# EAGLE design RxT6 (EAGLE 4.13)
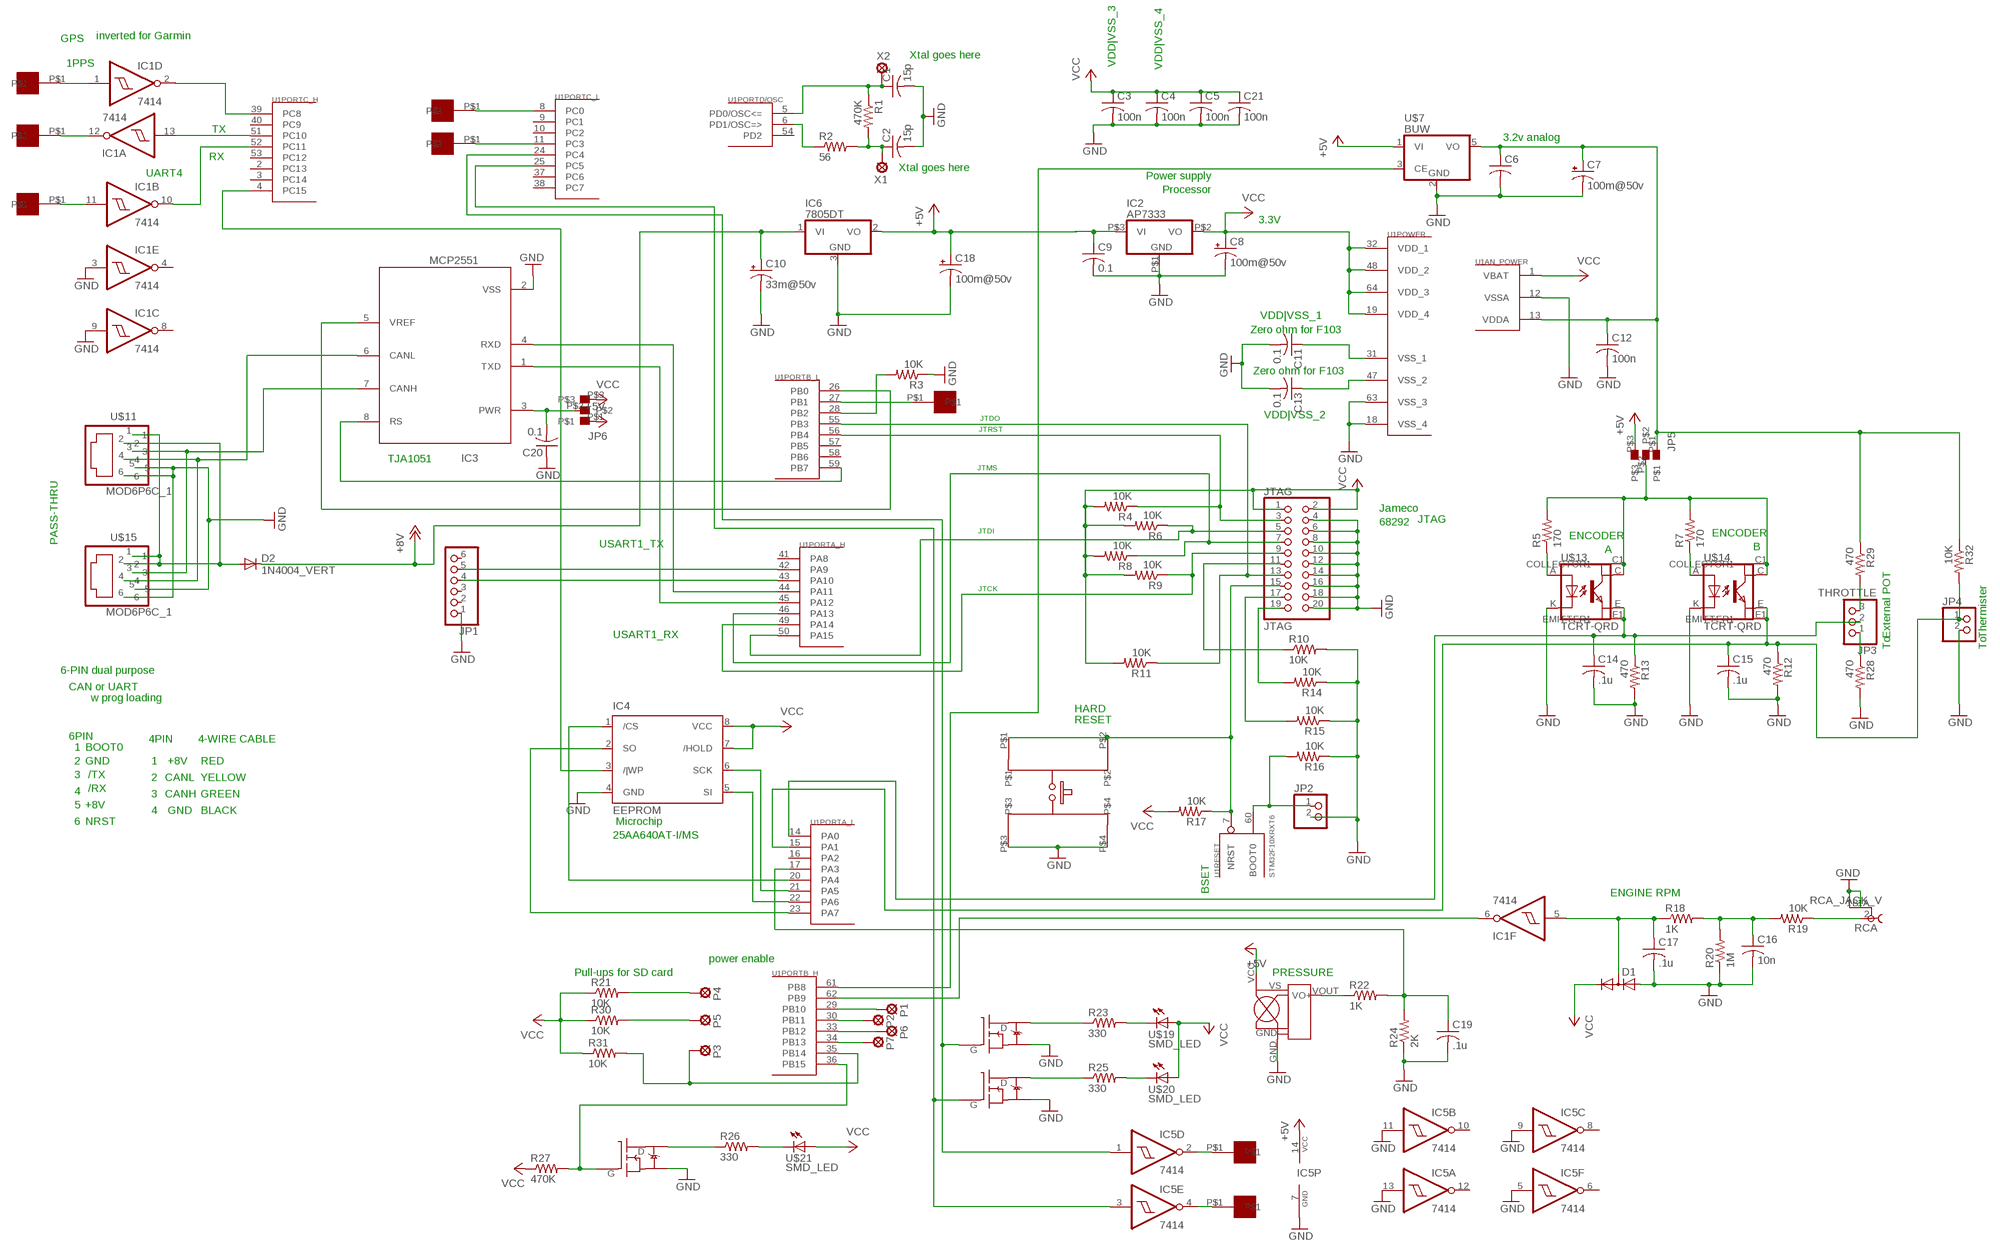
[diagram p0: schematic, sheet 1]

## Parts
C1  15p  C-USC0603  [C0603]
C2  15p  C-USC0603  [C0603]
C3  100n  C-USC0603  [C0603]
C4  100n  C-USC0603  [C0603]
C5  100n  C-USC0603  [C0603]
C6  C-USC0603  [C0603]
C7  100m@50v  CPOL-USE5-8.5  [E5-8,5]
C8  100m@50v  CPOL-USE5-8.5  [E5-8,5]
C9  0.1  C-USC0603  [C0603]
C10  33m@50v  CPOL-USE5-6  [E5-6]
C11  0.1  C-USC0603  [C0603]
C12  100n  C-USC0603  [C0603]
C13  0.1  C-USC0603  [C0603]
C14  .1u  C-USC0805  [C0805]
C15  .1u  C-USC0805  [C0805]
C16  10n  C-USC0805  [C0805]
C17  .1u  C-USC0805  [C0805]
C18  100m@50v  CPOL-USE5-8.5  [E5-8,5]
C19  .1u  C-USC0805  [C0805]
C20  0.1  C-USC0603  [C0603]
C21  100n  C-USC0603  [C0603]
D1  DIODE_2CACA-SOT23  [SOT23]
D2  1N4004_VERT  [DO41-10_VERT]
IC1  7414  [TSSOP14]
IC2  AP7333  MCP1702  [SOT-23A]
IC3  MCP2551  [SO-08]
IC4  EEPROM  [TSSOP8]
IC5  7414  [TSSOP14]
IC6  7805DT  [TO252]
JP1  PINHD-1X6  [1X06]
JP2  PINHD-1X2  [1X02]
JP3  THROTTLE  PINHD-1X3  [1X03]
JP4  PINHD-1X2  [1X02]
JP5  SMD-3  [SMD_3]
JP6  SMD-3  [SMD_3]
JTAG  JTAG  PINHD-2X10_KEYED  [2X10_KEYED]
P1  PE14  SOLDPAD028  [SOLPAD028]
P2  PE14  SOLDPAD028  [SOLPAD028]
P3  PE14  SOLDPAD028  [SOLPAD028]
P4  PE14  SOLDPAD028  [SOLPAD028]
P5  PE14  SOLDPAD028  [SOLPAD028]
P6  PE14  SOLDPAD028  [SOLPAD028]
P7  PE14  SOLDPAD028  [SOLPAD028]
Q1  IRLML2060  [SOT-23]
Q2  IRLML2060  [SOT-23]
Q3  IRLML2060  [SOT-23]
R1  470K  R-US_R0603  [R0603]
R2  56  R-US_R0603  [R0603]
R3  10K  R-US_R0603  [R0603]
R4  10K  R-US_R0603  [R0603]
R5  170  R-US_M0805  [M0805]
R6  10K  R-US_R0603  [R0603]
R7  170  R-US_M0805  [M0805]
R8  10K  R-US_R0603  [R0603]
R9  10K  R-US_R0603  [R0603]
R10  10K  R-US_R0603  [R0603]
R11  10K  R-US_R0603  [R0603]
R12  470  R-US_R0603  [R0603]
R13  470  R-US_R0603  [R0603]
R14  10K  R-US_R0603  [R0603]
R15  10K  R-US_R0603  [R0603]
R16  10K  R-US_R0603  [R0603]
R17  10K  R-US_R0603  [R0603]
R18  1K  R-US_R0603  [R0603]
R19  10K  R-US_R0603  [R0603]
R20  1M  R-US_R0603  [R0603]
R21  10K  R-US_R0603  [R0603]
R22  1K  R-US_R0603  [R0603]
R23  330  R-US_R0603  [R0603]
R24  2K  R-US_R0603  [R0603]
R25  330  R-US_R0603  [R0603]
R26  330  R-US_R0603  [R0603]
R27  470K  R-US_R0603  [R0603]
R28  470  R-US_R0603  [R0603]
R29  470  R-US_R0603  [R0603]
R30  10K  R-US_R0603  [R0603]
R31  10K  R-US_R0603  [R0603]
R32  10K  R-US_R0603  [R0603]
RCA  RCA_JACK_V  [RCA_JACK_V]
S1  SMD_1  [SMD_1]
S2  SMD_1  [SMD_1]
S3  SMD_1  [SMD_1]
S4  SMD_1  [SMD_1]
SW1  E-SWITCH  [E-SWITCH]
U1  STM32F10XRXT6  [TQFP64]
U$4  SMD_1  [SMD_1]
U$6  SMD_1  [SMD_1]
U$7  BUW  [SOT-25]
U$11  MOD6P6C_1  [MOD6P6C_1]
U$13  TCRT-QRD  [TCRT-QRD1114]
U$14  TCRT-QRD  [TCRT-QRD1114]
U$15  MOD6P6C_1  [MOD6P6C_1]
U$18  MPXV6115  [482A]
U$19  SMD_LED  [SMD_LED]
U$20  SMD_LED  [SMD_LED]
U$21  SMD_LED  [SMD_LED]
U$22  SMD_1  [SMD_1]
U$23  SMD_1  [SMD_1]
X1  SOLPAD035  [SOLDPAD035]
X2  SOLPAD035  [SOLDPAD035]

## Nets
1PPS_INPUT: IC1.1(D:I) S1.P$1
+5V: C9.1 C18.+ IC2.P$3(VI) IC5.14(P:VCC) IC6.2(VO) JP5.P$3 JP6.P$1 U$7.1(VI) U$18.VCC(VS)
+8V: C10.+ D2.C IC6.1(VI)
+V_RAW: D2.A U$11.1 U$11.2 U$15.1 U$15.2
BOOT0: JP2.1 R16.2 U1.60(RESET:BOOT0)
CAN_PWR: C20.2 IC3.3(PWR) JP6.P$2
CANH: IC3.7(CANH) U$11.3 U$15.3
CANL: IC3.6(CANL) U$11.4 U$15.4
EEPROM_/WP: IC4.3(/|WP) U1.4(PORTC_H:PC15)
ENCODER_A_ANODE: R5.1 U$13.A(ANODE)
ENCODER_B_ANODE: R7.1 U$14.A(ANODE)
GND: C1.2 C2.2 C3.2 C4.2 C5.2 C6.2 C7.- C8.- C9.2 C10.- C11.2 C12.2 C13.2 C14.2 C15.2 C16.2 C17.2 C18.- C19.2 C20.1 C21.2 D1.1(A) IC1.3(E:I) IC1.9(C:I) IC2.P$1(GND) IC3.2(VSS) IC4.4(GND) IC5.5(F:I) IC5.7(P:GND) IC5.9(C:I) IC5.11(B:I) IC5.13(A:I) IC6.3(GND) JP1.1 JP2.2 JP4.2 JTAG.4 JTAG.6 JTAG.8 JTAG.10 JTAG.12 JTAG.14 JTAG.16 JTAG.18 JTAG.20 Q1.2(S) Q2.2(S) Q3.2(S) R3.1 R10.2 R12.2 R13.2 R14.1 R15.1 R16.1 R20.1 R24.1 R28.2 RCA.1A RCA.1B SW1.P$3 SW1.P$4 U1.12(AN_POWER:VSSA) U1.18(POWER:VSS_4) U1.63(POWER:VSS_3) U$7.2(GND) U$11.5 U$11.6 U$13.K(CATHODE) U$14.K(CATHODE) U$15.5 U$15.6 U$18.GND
JTAG_R-TO-GND-11: JTAG.11 R10.1
JTAG_R-TO-GND-17: JTAG.17 R15.2
JTAG_R-TO-GND-19: JTAG.19 R14.2
JTDO: JTAG.13 R11.1 U1.55(PORTB_L:PB3)
JTRST: JTAG.3 R4.1 U1.56(PORTB_L:PB4)
N$1: JP3.1 R28.1
N$2: JP3.3 R29.2
NRST: JTAG.15 R17.1 SW1.P$1 SW1.P$2 U1.7(RESET:NRST)
PA0_PHOTO_EMITTER_A: C14.1 JP3.2 R13.1 U1.14(PORTA_L:PA0) U$13.E1(EMITTER1) U$13.E(EMITTER)
PA1_PHOTO_EMITTER_B: C15.1 JP4.1 R12.1 R32.2 U1.15(PORTA_L:PA1) U$14.E1(EMITTER1) U$14.E(EMITTER)
PA3_ADC123IN1_PRESSURE: C19.1 R22.2 R24.2 U1.17(PORTA_L:PA3)
PA4_EEPROM_/CS: IC4.1(/CS) U1.20(PORTA_L:PA4)
PA5_EEPROM_SCK: IC4.6(SCK) U1.21(PORTA_L:PA5)
PA6_EEPROM_SI: IC4.5(SI) U1.22(PORTA_L:PA6)
PA7_EEPROM_SO: IC4.2(SO) U1.23(PORTA_L:PA7)
PA9_USART1_TX: JP1.5 U1.42(PORTA_H:PA9)
PA10_USART1_RX: JP1.4 U1.43(PORTA_H:PA10)
PA11_CANRXD: IC3.4(RXD) U1.44(PORTA_H:PA11)
PA12_CANTXD: IC3.1(TXD) U1.45(PORTA_H:PA12)
PA13_JTIMS: JTAG.7 R8.1 U1.46(PORTA_H:PA13)
PA14_JTCK: JTAG.9 R9.1 U1.49(PORTA_H:PA14)
PA15_JTDI: JTAG.5 R6.1 U1.50(PORTA_H:PA15)
PB0_CAN_VREF: IC3.5(VREF) U1.26(PORTB_L:PB0)
PB1: S4.P$1 U1.27(PORTB_L:PB1)
PB2_BOOT1: R3.2 U1.28(PORTB_L:PB2)
PB7_CAN_RS: IC3.8(RS) U1.59(PORTB_L:PB7)
PB8_3.2V_ENABLE: U1.61(PORTB_H:PB8) U$7.3(CE)
PB10_USART3_TX|XBEE: P1.MP U1.29(PORTB_H:PB10)
PB11_ENG_PULSE: IC1.6(F:O) U1.62(PORTB_H:PB9)
PB11_USART3_RX|XBEE: P2.MP U1.30(PORTB_H:PB11)
PB12_LED_A_SERVO: IC5.2(D:O) U$22.P$1
PB12_SPI2_/CS: P6.MP U1.33(PORTB_H:PB12)
PB13_SPI2_SCK: P7.MP U1.34(PORTB_H:PB13)
PB14_SPI2_DO: P3.MP R31.2 U1.35(PORTB_H:PB14)
PB15_PWRLED: R26.2 U$21.C
PB15_PWRLED_D: Q3.3(D) R26.1
PB15_SPI2_DI: Q3.1(G) R27.2 U1.36(PORTB_H:PB15)
PB_13_LES_B_SERVO: IC5.4(E:O) U$23.P$1
PC0: U1.8(PORTC_L:PC0) U$4.P$1
PC3: U1.11(PORTC_L:PC3) U$6.P$1
PC4_LED: IC5.1(D:I) Q1.1(G) U1.24(PORTC_L:PC4)
PC4_LED1: R23.2 U$19.C
PC4_LED_D: Q1.3(D) R23.1
PC5_LED: IC5.3(E:I) Q2.1(G) U1.25(PORTC_L:PC5)
PC5_LED2: R25.2 U$20.C
PC5_LED_D: Q2.3(D) R25.1
PC8_HC74OUT: IC1.2(D:O) U1.39(PORTC_H:PC8)
PC10_UART4_INVERT: IC1.12(A:O) S2.P$1
PC10_USART4_TX_HC14IN: IC1.13(A:I) U1.51(PORTC_H:PC10)
PC11_UART4_INVERT: IC1.11(B:I) S3.P$1
PC11_USART4_RX_HC14OUT: IC1.10(B:O) U1.52(PORTC_H:PC11)
PD0_OSC_IN_XTAL: C1.1 R1.1 U1.5(PORTD/OSC:PD0/OSC<=) X2.MP
PD1_OSC_OUT: R2.1 U1.6(PORTD/OSC:PD1/OSC=>)
PD1_OSC_OUT_XTAL: C2.1 R1.2 R2.2 X1.MP
PHOTOSENSOR_V+: JP5.P$2 R5.2 R7.2 U$13.C1(COLLECTOR1) U$13.C(COLLECTOR) U$14.C1(COLLECTOR1) U$14.C(COLLECTOR)
PRESSURE_OUT: R22.1 U$18.VOUT
PU_SD_DAT1: P5.MP R30.2
PU_SD_DAT2: P4.MP R21.2
RPM_FILTERED: C17.1 D1.3(AC) IC1.5(F:I) R18.1
SPRK_PICKUP: C16.1 R18.2 R19.2 R20.2
SPRK_PICKUP_RAW: R19.1 RCA.2
V3.2_ANALOG: C6.1 C7.+ C12.1 JP5.P$1 R29.1 R32.1 U1.13(AN_POWER:VDDA) U$7.5(VO)
VCC: C3.1 C4.1 C5.1 C8.+ C21.1 D1.2(C) IC2.P$2(VO) IC4.7(/HOLD) IC4.8(VCC) JP6.P$3 JTAG.1 JTAG.2 R4.2 R6.2 R8.2 R9.2 R11.2 R17.2 R21.1 R27.1 R30.1 R31.1 U1.1(AN_POWER:VBAT) U1.19(POWER:VDD_4) U1.32(POWER:VDD_1) U1.48(POWER:VDD_2) U1.64(POWER:VDD_3) U$19.A U$20.A U$21.A
VSS_1: C11.1 U1.31(POWER:VSS_1)
VSS_2: C13.1 U1.47(POWER:VSS_2)
Unconnected: IC1.4(E:O) IC1.8(C:O) IC5.6(F:O) IC5.8(C:O) IC5.10(B:O) IC5.12(A:O) JP1.2 JP1.3 JP1.6 U1.2(PORTC_H:PC13) U1.3(PORTC_H:PC14) U1.9(PORTC_L:PC1) U1.10(PORTC_L:PC2) U1.16(PORTA_L:PA2) U1.37(PORTC_L:PC6) U1.38(PORTC_L:PC7) U1.40(PORTC_H:PC9) U1.41(PORTA_H:PA8) U1.53(PORTC_H:PC12) U1.54(PORTD/OSC:PD2) U1.57(PORTB_L:PB5) U1.58(PORTB_L:PB6)

## Notes on the sheet
- GPS | inverted for Garmin
- Xtal goes here
- 1PPS | VDD|VSS_3 | VDD|VSS_4
- TX
- 3.2v analog
- RX
- Xtal goes here
- UART4 | Power supply
- Processor
- 3.3V
- VDD|VSS_1
- Zero ohm for F103
- Zero ohm for F103
- JTDO
- VDD|VSS_2
- JTRST
- TJA1051
- JTMS
- Jameco
- 68292 | JTAG
- JTDI
- ENCODER | ENCODER
- PASS-THRU | USART1_TX
- A | B
- JTCK
- USART1_RX | External POT | Thermister
- To | To
- 6-PIN dual purpose
- CAN or UART
- w prog loading
- HARD
- RESET
- 6PIN | 4PIN | 4-WIRE CABLE
- 1 | BOOT0
- 2 | GND | 1 | +8V | RED
- 3 | /TX | 2 | CANL | YELLOW
- 4 | /RX
- 3 | CANH | GREEN
- 5 | +8V
- 4 | GND | BLACK
- 6 | NRST | Microchip
- 25AA640AT-I/MS
- BSET | ENGINE RPM
- power enable
- Pull-ups for SD card | PRESSURE

## Power pins joined to a net without a drawn wire
GND: IC1.7(P:GND)
VCC: IC1.14(P:VCC)

## Library data of the parts
C1-C6 C9 C11-C17 C19-C21 = rcl:C-US: CAPACITOR, American symbol
C7 C8 C10 C18 = rcl:CPOL-US: POLARIZED CAPACITOR, American symbol
D1 = diode-1:DIODE_2CACA-: 2 Diodes - Cathode-Anode|Cathode-Anode
D2 = diode:1N4004_VERT
IC1 IC5 = 74xx-us:74*14: Hex schmitt trigger INVERTER
IC2 = linear:MCP1702
IC3 = texas:MCP2551
IC4 = texas:EEPROM
IC6 = linear:78*: Positive VOLTAGE REGULATOR
JP1 = pinhead:PINHD-1X6: PIN HEADER
JP2 JP4 = pinhead:PINHD-1X2: PIN HEADER
JP3 = pinhead:PINHD-1X3: PIN HEADER
JP5 JP6 = solpad:SMD-3
JTAG = pinhead:PINHD-2X10_KEYED
P1-P7 = solpad:SOLDPAD028
Q1-Q3 = transistor-fet:IRLML2060
R1-R32 = rcl:R-US_: RESISTOR, American symbol
RCA = DEH:RCA_JACK_V
S1-S4 U$4 U$6 U$22 U$23 = solpad:SMD_1
SW1 = switch-misc:E-SWITCH
U1 = stm32:STM32F10XRXT6: STM32F101/103 64pin LQFP
U$7 = linear:BUW
U$11 U$15 = DEH:MOD6P6C_1
U$13 U$14 = tcrt5000:TCRT-QRD
U$18 = motorola-sensor-driver:MPXV6115
U$19-U$21 = led:SMD_LED
X1 X2 = solpad:SOLPAD035

## Board
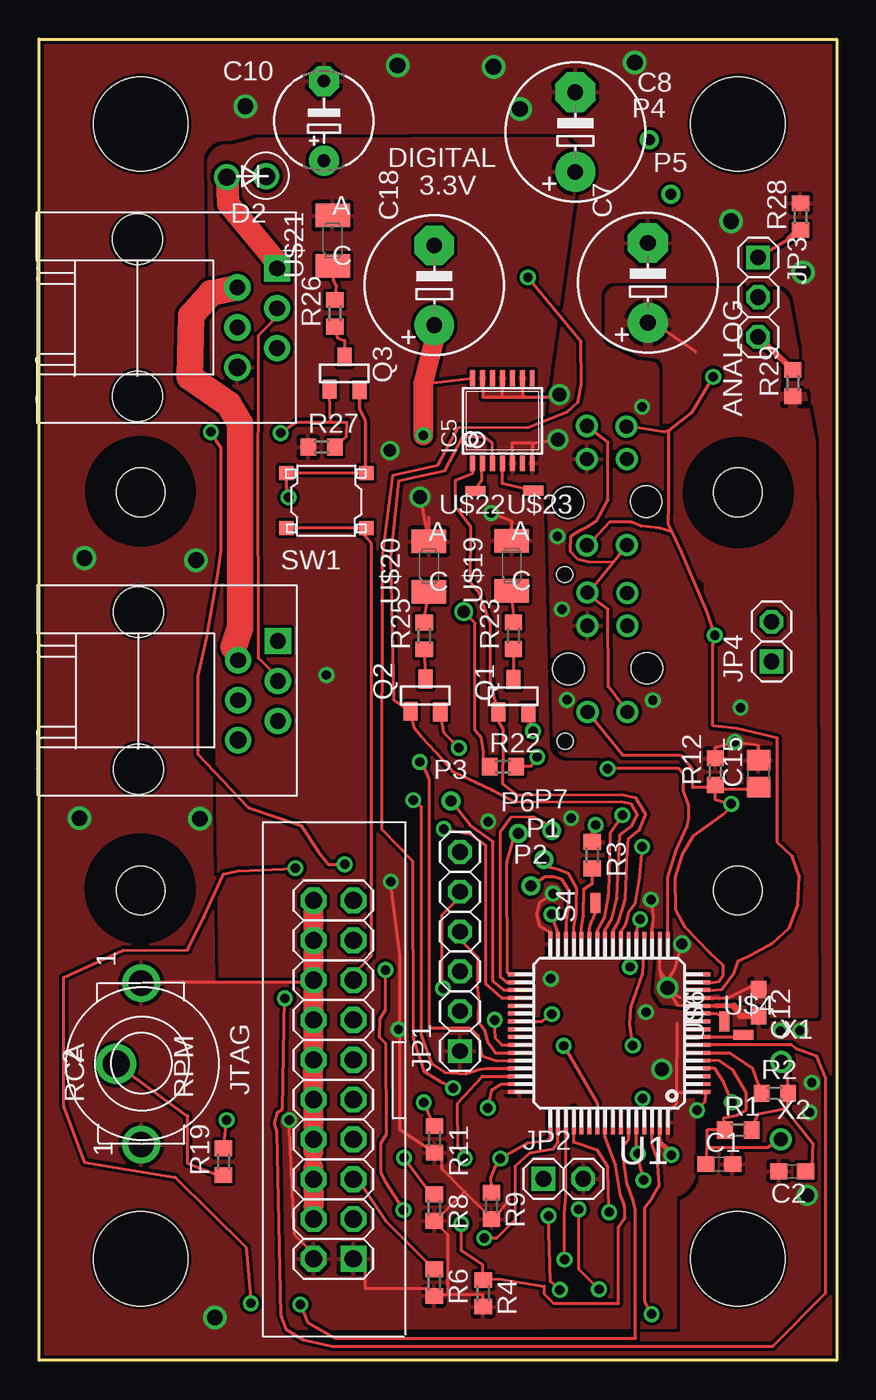
[diagram p1: board, top side]
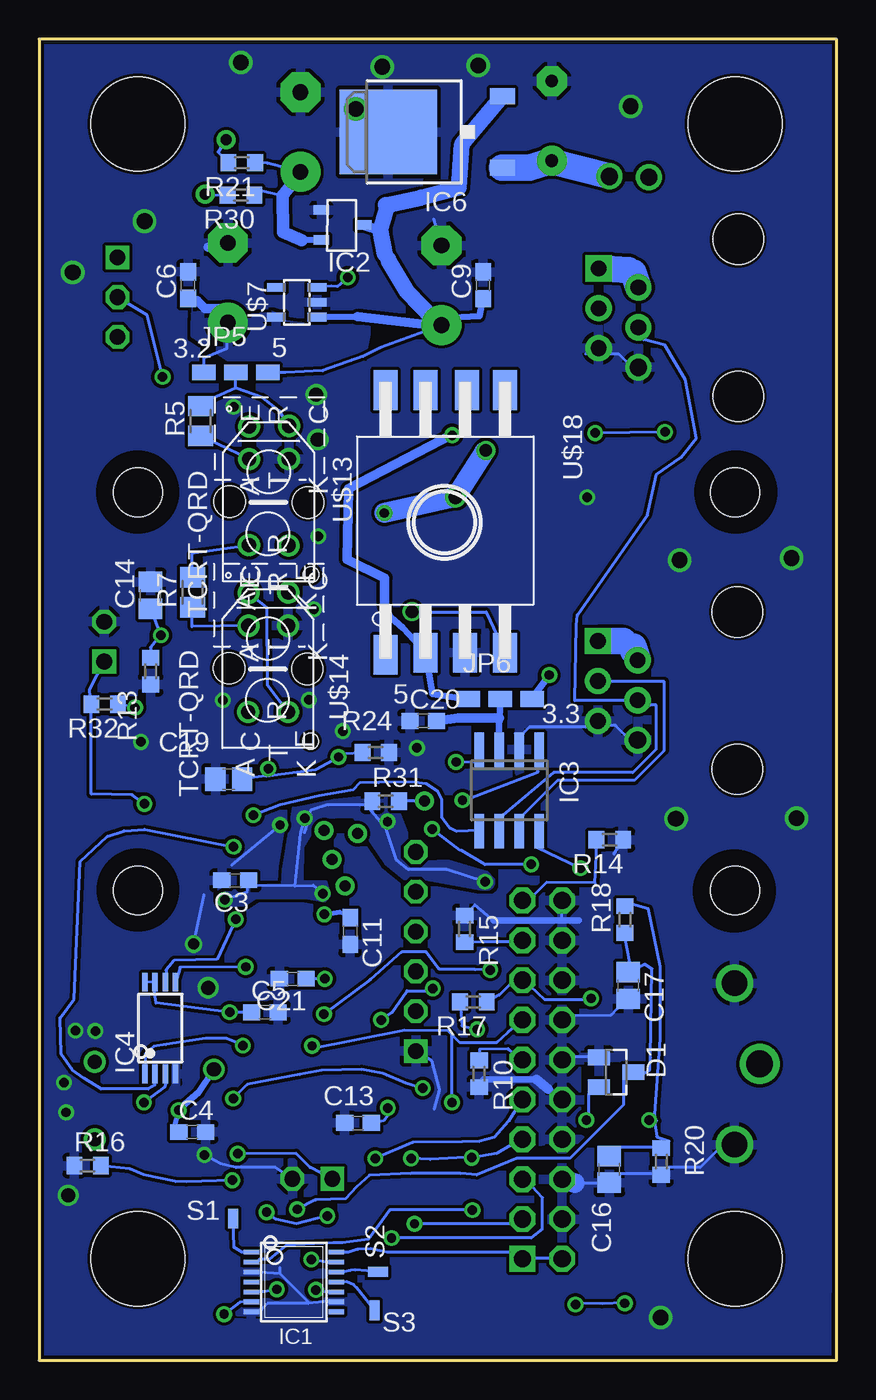
[diagram p2: board, bottom side, seen from below]

Size 50.88 x 84.28 mm. Coordinates in mm from the lower left corner, seen from the top.
Outline: 0,0 0,84.28 50.88,84.28 50.88,0 0,0
Copper layers (1*16): Top 0.035mm / dielectric 1.5mm / Bottom 0.035mm
Design rules "default": minimum track width 8mil, minimum drill 0.6mm, track to track 0.2083mm, track to pad 8mil, pad to pad 8mil, via to via 8mil, smd to smd 0mil, copper to edge 8mil, drill to drill 8mil, minimum pad ring 10mil, minimum via ring 8mil, stop-mask expansion 4mil, vias tented up to drill 0mil, thermal gap 10mil
Holes 6 mm at 6.48,6.48 44.58,6.48 6.48,78.87 44.58,78.87
Holes 3.1 mm at 6.48,29.97 6.48,55.37 44.58,29.97 44.58,55.37
tRestrict: area 41.2,51.9 to 48.1,58.8; area 41.1,26.6 to 47.9,33.4; area 3,26.7 to 9.9,33.5; area 3,52 to 9.9,58.9
bRestrict: area 4,27.4 to 9.1,32.5; area 3.9,52.9 to 9,57.9; area 42.1,52.9 to 47.1,57.9; area 42,27.5 to 47.1,32.6

### Footprints (pad centres in the part's own frame; a part is rotated, then mirrored left to right if it is on the bottom)
C0603 = smd 1.1 x 1: 1 -0.85,0; 2 0.85,0
E5-8,5 = drill 1 pad 2.54 round: + -2.54,0 | drill 1 pad 2.54 octagon: - 2.54,0
E5-6 = drill 0.8 pad 1.905 round: + -2.54,0 | drill 0.8 pad 1.905 octagon: - 2.54,0
C0805 = smd 1.3 x 1.5: 1 -0.85,0; 2 0.85,0
SOT23 = smd 1 x 1.4: 1 -0.95,-1.1; 2 0.95,-1.1; 3 0,1.1
DO41-10_VERT = drill 1.1 round: A 2.58,0.05; C 0.07,0
TSSOP14 = smd 0.305 x 0.991: 1 -1.905,-2.718; 2 -1.27,-2.718; 3 -0.635,-2.718; 4 0,-2.718; 5 0.635,-2.718; 6 1.27,-2.718; 7 1.905,-2.718; 8 1.905,2.718; 9 1.27,2.718; 10 0.635,2.718; 11 0,2.718; 12 -0.635,2.718; 13 -1.27,2.718; 14 -1.905,2.718
SOT-23A = smd 0.6 x 1: P$1 -0.95,-1.35; P$2 0.95,-1.35; P$3 0,1.35
SO-08 = smd 0.6 x 2.2: 1 -1.905,-2.6; 2 -0.635,-2.6; 3 0.635,-2.6; 4 1.905,-2.6; 5 1.905,2.6; 6 0.635,2.6; 7 -0.635,2.6; 8 -1.905,2.6
TSSOP8 = smd 1.2 x 0.35: 1 -2.925,0.975; 2 -2.925,0.325; 3 -2.925,-0.325; 4 -2.925,-0.975; 5 2.925,-0.975; 6 2.925,-0.325; 7 2.925,0.325; 8 2.925,0.975
TO252 = smd 1 x 1.6: 1 -2.28,-4.8; 2 2.28,-4.8 | smd 5.4 x 6.2: 3 0,2.5
1X06 = drill 1 square: 1 -6.35,0 | drill 1 octagon: 2 -3.81,0; 3 -1.27,0; 4 1.27,0; 5 3.81,0; 6 6.35,0
1X02 = drill 1 square: 1 -1.27,0 | drill 1 octagon: 2 1.27,0
1X03 = drill 1 square: 1 -2.54,0 | drill 1 octagon: 2 0,0; 3 2.54,0
SMD_3 = smd 1.5 x 1: P$1 -2.04,-0.27; P$2 0,-0.27; P$3 2.04,-0.27
2X10_KEYED = drill 1.1 square: 1 -11.46,-1.27 | drill 1.1 octagon: 2 -11.46,1.27; 3 -8.92,-1.27; 4 -8.92,1.27; 5 -6.38,-1.27; 6 -6.38,1.27; 7 -3.84,-1.27; 8 -3.84,1.27; 9 -1.3,-1.27; 10 -1.3,1.27; 11 1.24,-1.27; 12 1.24,1.27; 13 3.78,-1.27; 14 3.78,1.27; 15 6.32,-1.27; 16 6.32,1.27; 17 8.86,-1.27; 18 8.86,1.27; 19 11.4,-1.27; 20 11.4,1.27
SOLPAD028 = drill 0.7 pad 1.016 round: MP 0,0
SOT-23 = smd 0.9 x 1.2: 1 -1,-1.006; 2 0.9,-1.056; 3 -0.05,1.056
R0603 = smd 1 x 1.1: 1 -0.85,0; 2 0.85,0
M0805 = smd 1.3 x 1.6: 1 -0.95,0; 2 0.95,0
RCA_JACK_V = drill 1.6 round: 1A -5.15,0; 1B 5.15,0 | drill 1.7 round: 2 0,1.6
SMD_1 = smd 1.27 x 0.635: P$1 0,0
E-SWITCH = smd 0.9 x 0.9: P$1 -2.55,1.75; P$2 2.55,1.75; P$3 -2.55,-1.75; P$4 2.55,-1.75
TQFP64 = smd 1.5 x 0.25: 1 -5.7,3.75; 2 -5.7,3.25; 3 -5.7,2.75; 4 -5.7,2.25; 5 -5.7,1.75; 6 -5.7,1.25; 7 -5.7,0.75; 8 -5.7,0.25; 9 -5.7,-0.25; 10 -5.7,-0.75; 11 -5.7,-1.25; 12 -5.7,-1.75; 13 -5.7,-2.25; 14 -5.7,-2.75; 15 -5.7,-3.25; 16 -5.7,-3.75; 33 5.7,-3.75; 34 5.7,-3.25; 35 5.7,-2.75; 36 5.7,-2.25; 37 5.7,-1.75; 38 5.7,-1.25; 39 5.7,-0.75; 40 5.7,-0.25; 41 5.7,0.25; 42 5.7,0.75; 43 5.7,1.25; 44 5.7,1.75; 45 5.7,2.25; 46 5.7,2.75; 47 5.7,3.25; 48 5.7,3.75 | smd 0.25 x 1.5: 17 -3.75,-5.7; 18 -3.25,-5.7; 19 -2.75,-5.7; 20 -2.25,-5.7; 21 -1.75,-5.7; 22 -1.25,-5.7; 23 -0.75,-5.7; 24 -0.25,-5.7; 25 0.25,-5.7; 26 0.75,-5.7; 27 1.25,-5.7; 28 1.75,-5.7; 29 2.25,-5.7; 30 2.75,-5.7; 31 3.25,-5.7; 32 3.75,-5.7; 49 3.75,5.7; 50 3.25,5.7; 51 2.75,5.7; 52 2.25,5.7; 53 1.75,5.7; 54 1.25,5.7; 55 0.75,5.7; 56 0.25,5.7; 57 -0.25,5.7; 58 -0.75,5.7; 59 -1.25,5.7; 60 -1.75,5.7; 61 -2.25,5.7; 62 -2.75,5.7; 63 -3.25,5.7; 64 -3.75,5.7
SOT-25 = smd 0.55 x 1.2: 1 -0.95,-1.3; 2 0,-1.3; 3 0.95,-1.3; 4 0.95,1.3; 5 -0.95,1.3
MOD6P6C_1 = drill 1 pad 1.676 square: 1 -3.175,8.898 | drill 1 pad 1.676 round: 2 -1.951,6.358; 3 -0.627,8.898; 4 0.597,6.358; 5 1.921,8.898 | drill 1.1 pad 1.676 round: 6 3.145,6.358 | hole 3.2: -5.029,-0.01; 4.999,-0.01
TCRT-QRD1114 = drill 0.9 round: A -2.76,-1.26; C 2.73,-1.27; C1 -4.882,1.29; E 2.74,1.27; E1 -4.846,-1.25; K -2.76,1.28 | hole 2: 0,2.5; -0.05,-2.5 | hole 1: 4.6,2.7
482A = smd 2.54 x 1.524: GND 8.382,1.27; NC1 8.509,-3.81; NC2 -8.382,3.81; NC3 -8.382,1.397; NC4 -8.382,-1.27; NC5 -8.382,-3.81; VCC 8.382,-1.27; VOUT 8.382,3.81
SMD_LED = smd 2.2 x 1.5: A 0,1.6; C 0,-1.6
SOLDPAD035 = drill 0.9 pad 1.27 round: MP 0,0

### Placement (x,y rotation side)
C1  43.39,12.51 0 top
C2  48.05,12.06 180 top
C3  38.37,30.62 180 bottom
C4  41.12,14.57 0 bottom
C5  36.48,22.2 0 bottom
C6  41.38,68.59 90 bottom
C7  38.84,68.74 90 top
C8  34.21,78.36 90 top
C9  22.55,68.58 90 bottom
C10  18.17,79.07 90 top
C11  31.03,27.39 270 bottom
C12  45.91,22.82 270 top
C13  30.54,15.15 180 bottom
C14  43.78,48.8 90 bottom
C15  45.89,37.42 90 top
C16  14.51,12.18 270 bottom
C17  13.29,23.91 270 bottom
C18  25.21,68.58 90 top
C19  38.78,37.08 180 bottom
C20  26.37,40.79 0 bottom
C21  34.7,24.34 180 bottom
D1  14.06,18.38 270 bottom
D2  14.56,75.53 180 top
IC1  34.64,5 270 bottom
IC2  31.52,72.43 270 bottom
IC3  20.89,36.36 180 bottom
IC4  43.16,21.2 90 bottom
IC5  29.56,59.94 0 top
IC6  26.11,78.36 90 bottom
JP1  26.85,26.08 90 top
JP2  33.45,11.58 0 top
JP3  45.88,67.82 270 top
JP4  46.73,45.85 90 top
JP5  38.33,63.29 0 bottom
JP6  21.45,42.46 0 bottom
JTAG  18.78,17.93 90 top
P1  32.2,31.94 0 top
P2  31.37,30.26 0 top
P3  26.28,35.67 0 top
P4  38.94,77.86 0 top
P5  40.3,74.39 0 top
P6  30.57,33.6 0 top
P7  32.7,33.79 0 top
Q1  30.31,42.37 0 top
Q2  24.69,42.41 0 top
Q3  19.53,62.96 0 top
R1  44.6,14.69 0 top
R2  46.94,17.03 0 top
R3  35.29,32.22 270 top
R4  28.33,4.28 270 top
R5  40.57,59.92 90 bottom
R6  25.21,4.96 270 top
R7  41.09,49 90 bottom
R8  25.21,9.74 270 top
R9  28.85,9.86 270 top
R10  22.81,18.28 270 bottom
R11  25.23,14.1 270 top
R12  43.15,37.56 90 top
R13  43.77,43.96 270 bottom
R14  14.47,33.21 180 bottom
R15  23.73,27.52 270 bottom
R16  47.79,12.42 0 bottom
R17  23.18,22.86 180 bottom
R18  13.5,28.11 90 bottom
R19  11.76,12.67 90 top
R20  11.19,12.68 90 bottom
R21  37.95,76.4 180 bottom
R22  29.59,37.87 0 top
R23  30.26,46.22 90 top
R24  29.4,38.77 180 bottom
R25  24.57,46.22 90 top
R26  18.87,66.79 90 top
R27  18.02,58.26 0 top
R28  48.58,72.96 90 top
R29  48.09,62.34 90 top
R30  38.01,74.33 180 bottom
R31  28.77,35.67 0 bottom
R32  46.7,41.86 180 bottom
RCA  6.51,18.91 90 top
S1  38.51,9.04 270 bottom
S2  29.25,5.64 180 bottom
S3  29.48,3.2 270 bottom
S4  35.48,29.19 90 top
SW1  18.32,54.84 180 top
U1  36.36,20.87 180 top
U$4  44.93,20.76 0 top
U$6  43.71,21.61 90 top
U$7  34.45,67.5 90 bottom
U$11  6.34,42.71 270 top
U$13  36.23,54.73 270 bottom
U$14  36.27,44.1 270 bottom
U$15  6.29,66.49 270 top
U$18  24.97,53.52 270 bottom
U$19  30.15,50.69 0 top
U$20  24.87,50.64 0 top
U$21  18.72,71.43 0 top
U$22  27.84,55.46 0 top
U$23  31.53,55.47 0 top
X1  47.35,19.04 0 top
X2  47.33,14.1 0 top

### Tracks (layer width: path | path; a pad name or v marks a point on that pad's centre or on a via)
1PPS_INPUT
  Bottom 0.203: IC1.1 37.94,6.9 38.45,7.2 S1.P$1
+5V  (via drill 0.6)
  Top 0.203: 24.51,62.34 24.66,62.3 IC5.14
  Top 1.27: v24.52,59.02 24.51,62.34 25.3,65.3 25.3,65.35 C18.+
  Bottom 0.203: JP6.P$1 23.53,42.16 | C18.+ 25.21,65.94 | JP5.P$3 35.16,63.01 32.79,63.13 30.19,64.05 29.11,64.6 25.25,66.02 C18.+ | C18.+ 25.33,65.96
  Bottom 0.406: 28.84,48.11 28.42,47.37 27.67,46.71 U$18.VCC 25.77,42.52 23.53,42.16 | C18.+ 25.74,66.44 22.79,66.6 22.59,67.61 C9.1 | 29.1,72.05 29.06,72.05 | 30.57,66.58 U$7.1
  Bottom 0.61: 28.84,48.11 28.83,49.91 31.25,51.09 31.14,55.6 24.53,59.05 | 29.1,72.05 IC2.P$3 | 28.61,70.22 28.82,70.57 | 25.33,65.96 30.57,66.58
  Bottom 0.813: 29.1,72.05 29.1,72.09 | 28.66,73.64 28.72,73.72 28.76,73.7
  Bottom 1.016: 29.1,72.09 28.66,73.64 | IC6.2 23.89,77.59 24.1,74.82 26.51,74.18 28.76,73.7 | 25.74,66.44 27.37,68.13 28.61,70.22 | 28.82,70.57 29.1,72.05 | 24.53,59.05 v24.52,59.02
+8V
  Bottom 1.676: D2.C 18.25,76.49 C10.+ 19.61,76.09 21.34,76.09 IC6.1
+V_RAW
  Top 0.203: U$15.1 15.2,70
  Top 0.813: U$11.2 12.4,45.5
  Top 1.422: 15.2,70 12.04,73.78 D2.A
  Top 1.676: 12.4,45.5 12.82,46.75 12.81,59.76 12.09,61.01 9.6,62.73 9.69,66.66 10.97,68.09 U$15.2
  Bottom 0.203: 12.96,45.53 13.35,44.98 | 12.95,69.38 13.5,68.9 13.29,69.56
  Bottom 0.813: 13.35,44.98 13.61,45.88
  Bottom 1.676: U$11.2 12.96,45.53 | 13.61,45.88 U$11.1 | U$15.2 12.95,69.38 | 13.29,69.56 U$15.1
BOOT0  (via drill 0.6)
  Top 0.203: 38.1,13.2 38.1,14.5 U1.60 | 38.1,13.2 v38.56,11.49 | v38.21,13.18 38.1,13.2
  Bottom 0.203: v38.56,11.49 41.5,11.4 42.19,11.41 44.22,11.84 45.1,12.2 R16.2 | v38.21,13.18 34.5,13.2 33.6,12.3 JP2.1
CAN_PWR
  Bottom 0.203: IC3.3 21.6,39.08
  Bottom 0.406: 21.6,39.08 21.51,40.98 JP6.P$2
  Bottom 0.61: 21.51,40.98 21.53,40.98 24.15,40.99 C20.2
CANH
  Top 0.203: U$15.3 14.9,66.3 14,65.4 13.99,60.55 13.97,57.81 14,44.8 14.8,44 U$11.3
  Bottom 0.203: IC3.7 20,34.8 17.8,37 12.9,37 11,38.9 11,43.3 14.4,43.3 U$11.3
CANL
  Bottom 0.203: IC3.6 21.3,34.8 18.06,37.5 13,37.5 11.5,39 11.5,41.8 11.9,41.8 U$11.4 13.5,42.1 16.7,42.09 16.6,46.92 16.55,47.55 12.07,53.92 11.5,56.49 9.92,57.6 8.96,58.82 9.65,62.56 10.96,64.77 12.3,65.1 U$15.4
EEPROM_/WP  (via drill 0.6)
  Top 0.203: U1.4 43.11,18.61 43.68,17.74 v44.2,16.45
  Bottom 0.203: IC4.3 42.82,17.67 42.86,17.45 v44.2,16.45
ENCODER_A_ANODE
  Bottom 0.203: R5.1 40.15,58.77 U$13.A
ENCODER_B_ANODE
  Bottom 0.203: R7.1 41.12,46.8 37.55,46.86 U$14.A
GND  (via drill 0.6, 0.7, 0.9, 1)
  Top 0.203: 34.86,32.63 R3.1 35.3,33.62 v35.51,34.15 | JTAG.8 17.5,14.9 | 17.5,15.9 JTAG.10 17.5,17.12 | 17.5,9.8 JTAG.4 | JTAG.6 17.5,10.8 | 17.5,12.3 17.5,13.3 | JTAG.16 17.5,25 | 17.5,26 JTAG.18 17.5,27.6 | 17.5,19.9 JTAG.12 17.49,18.56 | 17.5,21.06 JTAG.14 17.52,22.29 | 17.5,23.5 JTAG.16 | 17.5,28.6 JTAG.20 | JTAG.16 16.7,24.1 7.6,24.1 | U1.63 39.61,14.11 39.66,13.83 | v40.34,13.1 40.12,13.38 | v40.1,23.77 39.91,23.64 40.9,23.14 | 39.61,24.88 U1.18 | v40.1,23.77 39.94,23.55 39.61,24.88 | v26.78,39.07 25.84,40.03 Q2.2 | v31.51,40.14 31.47,40.03 Q1.2 | v41.02,26.55 40.58,25.04 40.06,24.07 39.61,24.88 | SW1.P$3 20.31,56.6 | v15.91,55.06 15.78,55.72 SW1.P$4 20.28,56.63 SW1.P$3 | v33.2,61.6 32.48,61.46 30.98,61.46 | 30.98,61.46 30.88,61.46 30.86,62.63 IC5.9 | IC5.11 29.56,61.46 29.63,61.46 | 30.98,61.46 30.98,61.44 29.63,61.46 | IC5.13 28.31,61.44 29.63,61.44 29.63,61.46 | IC5.5 30.19,58.53 31.44,58.53 | 31.44,58.53 31.46,58.53 31.44,57.21 IC5.7 | 31.44,58.53 31.44,58.51 v33.1,58.74 | v40.1,23.77 40.11,23.75 40.75,22.63 U1.12 42.22,22.63 43.22,22.63 | Q3.2 20.45,60.7 20.82,59.97 20.81,57.12 20.27,56.55 SW1.P$3 | C15.2 45.88,39.25 44.42,39.46 v44.39,39.45 44.49,39.51 43.15,39.1 R12.2
  Top 0.305: 39.66,13.83 40,13.57 40.12,13.38 | 43.22,22.63 44.37,22.62
  Top 0.406: C12.2 44.75,21.97 44.37,22.62 | 17.5,28.6 17.51,28.2 17.35,28.11 17.36,28.1
  Top 1.27: 17.5,14.9 17.5,15.9 | 17.5,10.8 17.5,9.8 | 17.5,13.3 JTAG.8 | JTAG.6 17.5,12.3 | 17.5,25 17.5,26 | 17.5,19.9 17.5,21.06 | 17.52,22.29 17.5,23.5 | 17.5,27.6 17.5,28.6 | 17.5,17.12 17.49,18.56
  Bottom 0.203: 16,64.2 U$15.5 14.4,64.2 13.9,64.2 13.4,63.7 U$15.6 | C18.- 25.7,72.8 | v35.51,34.15 38.6,31.6 | 33.72,3.63 36.32,3.63 36.72,3.23 36.83,3.06 IC1.7 | 33.72,3.63 32.41,3.75 IC1.9 | 35.52,5.53 36.77,5.61 IC1.3 | 35.52,5.53 33.72,3.73 33.72,3.63 | JP2.2 35.8,12.3 38.33,12.3 39.31,12.55 40.36,13.1 v40.34,13.1 | 35.52,5.53 35.52,5.93 | 16.7,11.3 15.2,11.3 C16.2 13.8,11.9 11.7,11.9 R20.1 10.7,12.3 8.7,12.3 7.7,13.3 | 20.5,40 IC3.2 20,40 19.6,40.4 16,40.4 U$11.5 14.4,40.5 14.1,40.5 13.5,39.9 U$11.6 | 21.89,28.05 23.08,29.06 R15.1 | 16.44,28.07 17.57,28.2 JTAG.20 16.8,29.7 | 14.2,32.3 R14.1 | D1.1 15.8,19.4 16.7,19.4 JTAG.12 | C17.2 13.98,22.44 14.38,22.04 16.7,22 JTAG.14 | 22.54,17.93 R10.2 | C6.2 41.79,69.54 | v41.02,26.55 40.37,29.7 | 25.68,16.04 25.35,17.31 25.83,19.1 26.88,19.74 JP1.1
  Bottom 0.406: 21.89,28.05 19.22,28.05 16.44,28.07 | 19.14,17.91 22.54,17.93 | JTAG.10 18.37,17.29
  Bottom 0.61: 18.37,17.29 19.14,17.91 | 40.1,71 39.2,71 C7.-
  Bottom 1.27: 16.7,11.3 JTAG.6
  other vias: 10.25,34.56 2.56,34.59 2.88,51.18 10.01,51.05 13.15,80 22.87,82.61 28.99,82.52 44.15,72.67 48.56,21.03 49.02,10.53 49.3,17.71 49.16,15.82 38.01,82.79 30.68,79.83 11.22,2.73 38.47,60.83 39.16,42.11 33.68,42.13 33.07,52.57 33.36,47.91 48.74,69.41 47.3,21.01
  pour Bottom (rank 4): 50.35,83.96 50.62,83.91 50.49,0.43 50.32,0.37 0.62,0.33 0.62,0.51 0.29,84
  pour Top (rank 2): 41.11,22.64 41.07,24.82 41.68,26.44 41.41,26.97 40.94,27.35 40.57,27.19 40.56,26.5 40.48,25.65 39.49,25.63 39.37,24.62 39.28,23.53 39.79,22.76
  pour Top (rank 5): 0.2,0.04 50.85,0.04 50.86,84.21 0.05,84.22
  pour Bottom: 16.37,14.32 16.41,23.67 16.51,30 18.57,29.97 19.5,29.41 19.37,28.98 20.92,28.6 21.03,25.68 28.36,25.91 30.19,20.93 28.4,17.95 21.92,13.07
JTAG_R-TO-GND-11
  Bottom 0.203: R10.1 22.78,19.85 20.96,19.88 JTAG.11
JTAG_R-TO-GND-17
  Bottom 0.203: R15.2 22.7,26.7 20.8,26.7 JTAG.17
JTAG_R-TO-GND-19
  Bottom 0.203: R14.2 15.34,32.16 15.42,30.45 18.5,30.5 19.3,29.7 JTAG.19
JTDO  (via drill 0.6)
  Top 0.203: v24.54,16.45 25,15.4 R11.1 | v33.47,20.06 35.61,16.39 35.6,15.9 U1.55
  Bottom 0.203: 24.06,20.28 21.67,20.29 20.98,20.92 JTAG.13 | v24.54,16.45 24.54,20.76 24.06,20.28 | v33.47,20.06 33.68,19.84 27.57,21.05 24.78,21.03 24.06,20.28
JTRST  (via drill 0.6)
  Top 0.203: U1.56 36.1,14.5 36.1,14.3 36.77,12.5 37.08,10.57 37.28,10.09 37.36,9.74 37.38,9.1 36.95,8.51 36.97,3.63 32.82,3.63 32.22,4.23 32.22,4.73 29.3,5.2 R4.1 28.3,6.1 26.93,7.01 v26.93,8.71
  Bottom 0.203: v26.93,8.71 20.8,8.7 JTAG.3
N$1
  Top 0.203: JP3.1 47.85,71.55
  Top 0.406: 47.85,71.55 R28.1
N$2
  Top 0.203: 46.12,65.05 JP3.3
  Top 0.406: R29.2 46.12,65.05
NRST  (via drill 0.6)
  Top 0.203: v15.67,23.09 15.52,16.02 15.2,15.81 15.01,15.13 15.18,14.59 15.44,2.87 15.79,1.94 16.83,1.3 18.71,0.88 46.8,0.9 50.2,4.3 50.19,18.03 49.62,19.39 48.31,19.86 48.01,20.13 U1.7 | JTAG.15 20.4,25 21.2,25.8 21.2,52.1 20.31,53.11 SW1.P$1 | SW1.P$1 20.34,53.11 | SW1.P$1 SW1.P$2
  Bottom 0.203: R17.1 21.52,23.3 20.8,24 JTAG.15 19.57,23.87 18.62,23 15.72,23 v15.67,23.09
PA0_PHOTO_EMITTER_A  (via drill 0.6, 0.6 pad 0.3)
  Top 0.203: U1.14 42.75,23.61 43.55,23.67 44.35,24.76 44.61,25.48 45.42,25.85 46.81,26.62 47.87,27.59 48.42,29.02 48.51,30.88 48.07,32.15 47.09,33.05 47.1,39.69 44.53,40.3 43,40.47 42.99,45.62 v43.12,46.27 | JP3.2 45.91,67.84 | v43.01,62.74 41.65,60.47 40.19,59.3 | v43.12,46.27 42.62,47.71 40.99,51.61 40.39,52.84 | v43.11,46.26 43.3,46.32 v43.12,46.27 | U$13.E1 39.88,59.22 40.19,59.3 | 40.39,52.84 39.58,53.09 38.4,53.22 37.78,53.47 36.37,53.47 35,51.98 U$13.E | 40.19,59.3 40.17,54.61 40.14,53.36 40.39,52.84
  Bottom 0.203: v43.01,62.74 43.99,66.68 45.9,67.82 JP3.2 | v43.11,46.26 C14.1 | R13.1 43.77,45.48 43.14,46.26 v43.11,46.26 | v43.11,46.26 v43.11,46.27
PA1_PHOTO_EMITTER_B  (via drill 0.6)
  Top 0.203: U1.15 42.17,24.09 43.01,24.1 43.38,24.18 43.65,24.59 43.65,25.2 42.8,25.99 41.24,27.62 40.62,28.74 40.6,30.79 41.08,32.33 41.75,33.46 42.85,34.26 43.7,34.86 44.09,35.26 | 44.09,35.26 44.17,35.47 43.16,35.75 R12.1 | R12.1 43.31,36.46 45.84,36.45 C15.1 | R12.1 43.22,36.55 41.7,36.54 41.68,37.71 40.94,38.58 37.24,38.59 35.01,41.34 U$14.E | 44.09,35.26 43.9,35.39 v44.16,35.5
  Bottom 0.203: JP4.1 47.66,42.78 47.58,41.86 R32.2 47.56,36.12 44.94,36.07 v44.16,35.5 | U$14.E1 36.35,48.03 36.31,43.05 35,41.34 U$14.E
PA3_ADC123IN1_PRESSURE  (via drill 0.6, 0.6 pad 0.3)
  Top 0.203: U1.17 40.1,27.3 40.1,30.8 40.65,32.57 41.34,34.02 41.45,34.52 41.44,35.41 41.12,36.34 41.12,37.32 40.81,37.74 v36.27,37.74 | R22.2 30.47,37.94 30.58,37.92 30.45,37.89 31.39,37.89 v31.78,38.49
  Bottom 0.203: R24.2 31.44,38.71 v31.78,38.49 33.24,37.68 36.39,37.27 | 36.39,37.27 C19.1 | 36.39,37.27 36.39,37.25 v36.27,37.74
PA4_EEPROM_/CS  (via drill 0.6)
  Top 0.203: U1.20 38.51,24.67 37.76,22.51 37.69,21.43 v37.88,20.08
  Bottom 0.203: IC4.1 44.11,19.55 43.57,20.02 42.78,20.14 40.25,20.54 38.95,20.54 v37.88,20.08
PA5_EEPROM_SCK  (via drill 0.6)
  Top 0.203: v38.34,28.13 38.1,27.3 U1.21
  Bottom 0.203: v38.34,28.13 39.54,25.58 42.27,25.51 42.79,24.9 IC4.6
PA6_EEPROM_SI  (via drill 0.6)
  Top 0.203: v37.7,25.1 37.6,25.2 37.6,25.9 U1.22
  Bottom 0.203: v37.7,25.1 41.89,25.08 IC4.5
PA7_EEPROM_SO  (via drill 0.6)
  Top 0.203: U1.23 37.1,27.3 37.31,27.62 37.44,27.93 37.61,28.55 38,29.13 38.31,30.88 38.42,32.34 v38.48,32.76
  Bottom 0.203: IC4.2 43.49,17.56 43.91,17.31 46.93,17.31 48,18 48.78,18.54 49.48,19.53 49.55,21.85 48.66,23.06 48.27,31.82 46.53,33.43 45.47,33.78 44.15,33.87 v38.48,32.76
PA9_USART1_TX  (via drill 0.6)
  Top 0.203: v29.06,21.71 29.1,20.55 29.52,20.12 U1.42 | v25.77,23.72 25.7,23.8 25.7,28.4 26.5,29.2 JP1.5
  Bottom 0.203: v29.06,21.71 28.37,22.18 27.42,23.57 26.23,23.58 v25.77,23.72
PA10_USART1_RX
  Top 0.203: JP1.4 27.1,26.6 28,25.7 28,24.16 27.98,23.84 28.06,23.15 28.04,21.57 28.46,21.02 28.67,20.23 29.11,19.61 U1.43
PA11_CANRXD  (via drill 0.6)
  Top 0.203: v24.28,38.17 24.6,37.8 24.9,37.07 24.9,21.2 27.5,21.2 28,20.7 28.25,19.42 29.22,19.11 U1.44 30.7,19.12
  Bottom 0.203: v24.28,38.17 23,38.2 IC3.4
PA12_CANTXD  (via drill 0.6)
  Top 0.203: v23.87,35.73 23.9,35.8 23.87,35.7 24.4,35.31 24.38,20.75 25.06,18.9 25.87,18.37 27.21,18.28 28.06,18.56 28.46,18.61 29.02,18.62 U1.45
  Bottom 0.203: IC3.1 19.05,37.54 23.87,35.69 v23.87,35.73
PA13_JTIMS  (via drill 0.6)
  Top 0.203: v23.28,12.92 24.7,11 R8.1 | v27.15,12.88 27.23,13.05 | 27.23,13.05 26.88,12.87 | 27.23,13.05 26.72,13.62 26.7,16.4 28.28,18.13 U1.46 | U1.46 | U1.46
  Bottom 0.203: JTAG.7 20.8,13.7 21.68,13.2 v23.28,12.92 23.64,12.94 25.93,12.82 v27.15,12.88
PA14_JTCK  (via drill 0.6)
  Top 0.203: R9.1 28.79,11.62 29.03,12.21 v29.43,12.87 31.17,13.88 32.43,14.02 32.62,14.21 32.62,15.13 U1.49
  Bottom 0.203: v29.43,12.87 27.03,13.9 23.89,13.94 22.8,13.96 21.83,14.23 20.95,15.26 20.45,16 JTAG.9
PA15_JTDI  (via drill 0.6)
  Top 0.203: R6.1 24.7,6.3 22.17,8.83 20.76,10.93 JTAG.5 | v28.4,7.8 29.2,7.8 30.4,9 30.4,12.4 31.33,13.24 32.79,13.48 33.11,13.91 33.13,15.11 U1.50
  Bottom 0.203: v28.4,7.8 19.5,7.8 18.78,8.38 18.76,10.37 19.39,11.06 JTAG.5
PB0_CAN_VREF  (via drill 0.6)
  Top 0.203: U1.26 35.61,27.45 36.08,28.27 36.32,29.72 36.42,33.58 v37.22,34.77
  Bottom 0.203: v37.22,34.77 35.51,35.43 33.04,36.01 30.84,36.39 30.43,36.84 29.22,36.85 27.64,36.88 26.89,36.86 26.15,36.77 25.44,36.3 25.19,35.78 25.18,34.6 24.69,33.95 24.25,33.75 22.8,33.79 IC3.5
PB1
  Top 0.203: U1.27 35.12,27.52 35.22,27.86 35.25,28.03 35.37,28.23 35.48,28.53 S4.P$1
PB2_BOOT1
  Top 0.203: U1.28 34.61,27.61 34.74,28.31 34.77,30.08 35.31,30.41 35.3,30.75 R3.2
PB7_CAN_RS  (via drill 0.6)
  Top 0.203: 38.05,1.4 18.9,1.4 17.13,2.42 v16.66,3.56 | v16.34,31.39 12.7,31.22 11.76,31.02 10.5,28.25 9.48,26.18 5.34,26.16 1.57,24.43 1.57,16.24 2.9,12.62 8.68,11.68 13.2,7.21 13.53,3.61 v13.51,3.64 | U1.59 37.6,15.9 37.62,14.15 37.28,13.67 37.23,13.12 37.5,11.32 37.89,10.24 38.05,9.61 38.05,1.4 | 38.05,1.4 38.05,1.39
  Bottom 0.203: v16.34,31.39 19.1,32.7 IC3.8 | v13.51,3.64 13.53,3.67 14.97,3.62 16.67,3.64 v16.66,3.57 v16.66,3.56
PB8_3.2V_ENABLE  (via drill 0.6)
  Top 0.203: v38.5,16.7 38.6,16.6 38.6,15.9 U1.61 | v31.19,69.08 34.57,64.98 34.59,62.29 34.39,61.12 33.7,60.53 31.16,59.51 26.76,59.52 25.46,57.12 22.57,56.46 21.9,51.29 21.89,33.86 23.85,31.81 23.89,20.55 24.58,18.39 25.68,17.72 v26.41,17.36
  Bottom 0.203: v26.41,17.36 27.46,17.67 28.98,18.32 30.3,18.56 32.87,18.5 34.26,18.23 37.6,17.6 v38.5,16.7 | v31.19,69.08 31.86,68.5 32.23,68.53 U$7.3
PB10_USART3_TX|XBEE
  Top 0.203: U1.29 34.11,27.69 34.27,28.52 34.27,29.19 34.3,30.1 33.79,31.02 33.11,31.31 32.6,31.43 32.29,31.87 P1.MP
PB11_ENG_PULSE  (via drill 0.6)
  Top 0.203: v39.08,2.94 38.64,3.73 38.65,9.77 39.09,10.34 39.56,11.16 39.45,12.88 39.14,13.71 39.1,14.5 U1.62
  Bottom 0.203: v39.08,2.94 38.08,3.71 IC1.6
PB11_USART3_RX|XBEE
  Top 0.203: U1.30 33.63,27.81 33.68,28.26 33.78,28.75 33.79,29.96 33.37,30.69 32.85,30.84 32.27,30.84 31.92,30.61 31.39,30.29 P2.MP
PB12_LED_A_SERVO
  Top 0.203: IC5.2 28.25,56.18 27.81,55.54 U$22.P$1
PB12_SPI2_/CS
  Top 0.203: U1.33 29.88,24.7 29.85,31.79 30.37,33.55 P6.MP
PB13_SPI2_SCK
  Top 0.203: U1.34 31.4,24.1 29.84,24.1 29.42,24.44 29.42,33.73 30.1,34.65 31.51,34.68 32.39,34.22 P7.MP
PB14_SPI2_DO
  Top 0.203: U1.35 29.63,23.62 28.96,24.18 28.96,33.1 27.51,34.12 P3.MP
  Bottom 0.203: P3.MP 26.26,35.67 | 26.26,35.67 R31.2 | 26.26,35.67 26.26,35.65
PB15_PWRLED
  Top 0.203: R26.2 18.98,68.52 18.79,68.95 18.79,69.85 U$21.C
  Top 0.305: U$21.C 18.94,69.96
PB15_PWRLED_D
  Top 0.203: Q3.3 19.49,65.05 19.01,65.24 18.92,65.93 R26.1
PB15_SPI2_DI  (via drill 0.6)
  Top 0.203: U1.36 29.5,23.12 28.48,24 28.48,32.86 27.49,33.59 v25.81,33.89 25.85,33.88 | Q3.1 18.55,60.39 18.58,59.86 | v15.41,59.16 16.42,59.86 18.37,59.86 18.58,59.86 | v10.95,59.22 11.6,58.2 11.6,51.62 11.43,50.26 10.68,46.07 10.13,43.67 10.13,38.65 13.34,35.28 16.72,34.11 17.84,32.44 18.47,31.63 19.51,31.63 v19.49,31.64 | R27.2 19.59,58.92 19.62,59.84 18.58,59.86
  Bottom 0.203: v19.49,31.64 22.44,31.63 23.94,32.53 23.99,32.53 v25.81,33.89 | v10.95,59.22 v15.41,59.16
PB_13_LES_B_SERVO
  Top 0.203: IC5.4 29.56,55.92 31.57,55.45 U$23.P$1
PC0
  Top 0.203: U1.8 44.57,20.62 45.33,20.75 U$4.P$1
PC3
  Top 0.203: U1.11 43.23,22.13 43.78,21.66 U$6.P$1
PC4_LED
  Top 0.203: U1.24 36.61,27.36 36.95,27.97 37.24,28.87 37.42,29.43 37.54,32.54 37.59,33.25 38.31,33.82 38.71,34.82 38.07,35.88 37.14,36.07 30.56,36.02 29.6,36.76 29.61,39.28 29.61,40.25 29.35,40.72 Q1.1 29.32,41.42 29.04,42.22 28.8,43.32 28.8,47.05 28.48,47.84 28.09,48.93 27.53,49.62 27.54,53.17 26.57,54.44 26.56,56.15 27.67,56.61 IC5.1
PC4_LED1
  Top 0.203: R23.2 30.32,47.13 U$19.C
PC4_LED_D
  Top 0.203: Q1.3 30.26,43.47 R23.1
PC5_LED
  Top 0.203: IC5.3 28.9,57.13 28.88,58.52 28.39,58.93 27.03,58.92 25.88,56.75 22.97,56.11 22.45,51.25 22.63,42.14 Q2.1 23.94,40.31 24.41,39.78 25.36,38.75 26.42,37.54 28.91,36.35 30.36,35.58 37.14,35.62 37.78,35.48 38.18,34.81 37.82,34.1 37.04,33.51 36.87,29.46 36.54,28.18 36.11,27.41 U1.25
PC5_LED2
  Top 0.203: R25.2 24.57,47.21 U$20.C
PC5_LED_D
  Top 0.203: Q2.3 24.63,43.56 R25.1
PC8_HC74OUT  (via drill 0.6)
  Top 0.203: v23.24,9.59 22.1,11.4 21.82,12 21.82,13.86 22.15,14.4 22.13,20.18 21.73,20.61 21.75,21.77 22.1,22.35 v22.1,24.9 | v32.71,22.09 32.02,21.59 31.6,21.6 31.4,21.6 U1.39
  Bottom 0.203: v23.24,9.59 28.5,9.59 29.86,7.72 31.52,7.51 32.1,7.51 35.14,7.33 36.22,6.43 36.82,6.43 36.92,6.33 IC1.2 | v22.1,24.9 23.06,24.93 25.36,24.94 26.19,26.06 27.75,26.04 29.74,24.31 v32.71,22.09
PC10_UART4_INVERT
  Bottom 0.203: IC1.12 31.41,5.65 31.02,5.73 30.72,5.77 S2.P$1
PC10_USART4_TX_HC14IN  (via drill 0.6)
  Top 0.203: v33.52,6.43 33.51,9.35 33.6,10.54 33.61,12.76 33.6,14.3 33.6,14.5 U1.51
  Bottom 0.203: v33.52,6.43 33.03,6.34 32.55,6.24 IC1.13
PC11_UART4_INVERT
  Bottom 0.203: IC1.11 31.6,4.97 31.26,5.01 30.82,4.83 30.62,4.63 S3.P$1
PC11_USART4_RX_HC14OUT  (via drill 0.6)
  Top 0.203: v33.22,4.49 32.62,5.03 v32.5,9.21 | 34.1,16.1 34.1,15.9 U1.52 34.11,13.89 35.62,13.38 36.29,12.33 36.32,10.65 v36.37,9.45
  Bottom 0.203: v33.22,4.49 32.8,4.37 32.34,4.36 IC1.10 | v32.5,9.21 34.45,8.71 35.76,9.01 v36.37,9.45
PD0_OSC_IN_XTAL
  Top 0.203: U1.5 43.42,19.11 44.27,18.53 45.11,17.07 45.11,15.99 44.49,15.63 43.7,15.48 43.75,14.78 R1.1 43.75,14.73 42.65,14.73 42.65,13.58 | C1.1 42.65,13.58 | X2.MP 46.47,13.6 42.92,13.6 42.65,13.58
PD1_OSC_OUT
  Top 0.203: U1.6 44.05,19.62 45.49,18.64 46.05,17.08 R2.1
PD1_OSC_OUT_XTAL
  Top 0.203: X1.MP 47.73,18.17 47.84,17.06 R2.2 47.73,16.09 47.52,16.05 | 47.52,16.05 45.9,15.73 R1.2 | C2.1 49.31,12.38 49.35,13.83 48.11,15.41 47.52,16.07 47.52,16.05
PHOTOSENSOR_V+
  Top 0.203: 34.98,48.88 U$14.C1 | 34.98,48.88 36.29,47.94 36.31,42.98 37.57,41.34 U$14.C | 34.98,48.88 36.61,50.89 | 36.61,50.89 35.06,50.92 34.36,51.09 33.89,51.61 33.93,52.57 34.53,52.98 35.04,53.21 35.6,53.58 36.3,54.87 36.3,58.57 35,59.56 U$13.C1 | U$13.C 36.61,50.89
  Bottom 0.203: 38.13,63.12 JP5.P$2 38.34,62.03 | 38.34,62.03 39.62,61.46 40.81,61.12 R5.2 | U$14.C1 35.01,48.99 | 38.34,62.03 36.64,61.43 35.58,60.58 U$13.C1 | R7.2 41.09,49.88 41.15,50.82 41.14,51.46 37.51,51.98 U$13.C
PRESSURE_OUT  (via drill 0.8)
  Top 0.203: v27.09,47.76 27.82,47.03 27.82,40.17 28.21,39.7 28.35,38.83 28.36,38.02 R22.1
  Bottom 0.203: v27.09,47.76 26.19,47.75 25.15,47.73 22.36,47.75 U$18.VOUT
PU_SD_DAT1
  Bottom 0.203: P5.MP 39.69,74.33 39.08,74.37 R30.2
PU_SD_DAT2
  Bottom 0.203: P4.MP 39.47,77.08 R21.2
RPM_FILTERED  (via drill 0.6)
  Top 0.203: v35.72,4.53 34.42,5.83 v34.42,9.63
  Bottom 0.203: R18.1 13.5,27 13.18,25.34 C17.1 12.24,25.26 11.78,24.98 11.88,19.3 11.92,18.52 12.25,18.33 D1.3 13.6,17.9 13.6,16.3 17,12.9 20.4,12.9 22.95,11.83 23.99,11.92 27.16,11.92 29.81,11.81 30.66,11.04 31.32,10.31 33.23,10.23 v34.42,9.63 | v35.72,4.53 36.52,4.38 36.98,4.36 IC1.5
SPRK_PICKUP  (via drill 0.6)
  Top 0.203: R19.2 v11.96,15.32
  Bottom 0.203: C16.1 13.8,13.6 11.7,13.6 R20.2 10.7,14 11.47,14.27 11.62,15.26 | R18.2 13.21,29.16 12.81,29.03 12.01,28.79 11.25,25.1 11.25,20.52 11.62,15.26 | 11.62,15.26 11.48,15.28 v11.96,15.32
SPRK_PICKUP_RAW
  Top 0.203: 9.48,15.55 9.48,12.56 11.8,11.66 R19.1 | 9.48,15.55 9.48,15.62 | 9.48,15.55 RCA.2
V3.2_ANALOG  (via drill 0.6)
  Top 0.203: 41.87,64.34 39.2,66.2 C7.+ | U1.13 43.95,23.11 45.34,23.82 45.96,23.63 C12.1 | v44.76,41.64 44.73,41.67
  Bottom 0.203: 39.2,67.1 C7.+ 38.85,66.18 38.89,64.56 40.36,63.98 JP5.P$1 | v44.76,41.64 R32.1
  Bottom 0.61: 39.2,67.1 40.3,67.1 40.8,67.6 C6.1
  pour Top (rank 2): 49.42,22.11 43.15,22.13 42.7,49.74 40.07,51.77 40.07,63.32 arc90 39.24,64.23 38.4,64.32 36.9,65.04 arc-90 36.37,65.99 36.37,67.79 arc-90 37.13,68.25 46.25,68.23 arc-90 47.62,67.37 49.28,58.48
  pour Bottom (rank 2): 36.84,63.66 arc61 38.3,63.71 38.35,63.71 40.96,65.46 40.87,67.1 36.82,66.47 arc103 35.36,66.1 33.54,65.84 29.95,65.83 30.28,64.22 31.36,63.64
VCC  (via drill 0.6, 0.6 pad 0.3, 0.8, 0.9)
  Top 0.203: 26.1,4.2 28.3,4.2 R4.2 | 26.1,4.2 25.7,4.2 R6.2 24.7,4.6 20.8,4.6 20.8,5.7 JTAG.1 | 26.1,4.2 26.1,8 25.7,8.4 R8.2 25.7,9.3 27.15,10.75 | 27.15,10.75 25.7,12.2 25.7,12.8 R11.2 24.7,13.6 23.01,14.7 23.01,25.83 v22.43,30.53 | 27.15,10.75 28.4,9.5 R9.2 29.4,9.5 29.96,10.26 | v15.96,15.33 16.3,8 17.1,7.2 JTAG.2 | v39.04,29.38 39.19,28.24 39.14,27.86 39.1,27.3 U1.19 39.1,25.9 | v32.79,29.78 31.93,29.21 31.74,28.43 31.93,27.71 32.61,27.3 U1.32 | 40.7,17.1 40.7,16.4 40.2,15.9 U1.64 | 40.7,17.1 40.72,21.5 | 40.7,17.1 41.4,17.1 U1.1 42.5,17 42.49,16.49 v41.98,15.95 | v39.73,18.57 39.5,18.56 | 30.1,52.31 U$19.A 30.13,53.56 v28.85,54.05 | 24.86,53.77 U$20.A v24.32,55.07 24.34,55.07 24.36,55.05 24.36,55.11
  Bottom 0.203: IC1.14 31.15,6.9 30.55,7.08 29.73,7.12 28.7,6.9 20.8,6.9 JTAG.1 19.3,6.5 18.3,6.5 JTAG.2 | v15.96,15.33 15.8,15.1 15.8,17 D1.2 | v39.04,29.38 37.64,29.86 C3.1 37.3,30.3 34.57,30.26 | v32.79,29.78 33.4,30.3 34.57,30.26 | v41.98,15.95 41.8,16.16 | 34.57,30.26 34.22,33.57 v33.94,34.58 33.5,35.1 32.5,35.44 30.03,35.43 28.76,33.94 28.07,31.93 27.3,31.3 24.9,31.3 v22.43,30.53 | 33.95,33.65 33.55,34.84 | v24.3,55.09 v24.32,55.08 v24.31,55.08 v24.32,55.07 | IC4.8 44.16,24.13 IC4.7 43.57,23.86 43.43,22.79 v38.72,22.21 38.75,22.2 C5.1 | JP6.P$3 19.47,42.19 | R21.1 36.31,76.36 34.18,75.79 C8.+ | R30.1 36.63,74.58 35.56,74.34 35.35,74.31 | 32.4,24.4 v32.65,24.34 C21.1 | v22.93,21.11 23.91,21.35 R17.2
  Bottom 0.305: v41.98,15.95 42.3,14.79 C4.1
  Bottom 0.406: v39.73,18.57 40.69,17.08 41.8,16.16 | 19.47,42.19 v18.33,43.72 | IC2.P$2 34.13,71.45
  Bottom 0.813: 34.13,71.45 35.31,71.97 35.35,74.31 34.2,75.75 C8.+
  Bottom 1.27: v24.3,55.09 22.48,57.94 | v24.32,55.07 v28.85,54.05
  other vias: 28.65,34.37 22.38,58.04
  pour Top (rank 3): 31.98,59.2 32.45,39.44 arc90 33.66,38.17 41.3,38.16 arc-90 41.67,37.84 41.76,11.71 arc-57 40.6,10.47 40.6,2.08 15.02,1.98 15.01,9.77 11.75,10.65 10.81,76.56 arc-90 12.29,77.47 13.98,77.92 33.5,77.99 34.47,76.99
  pour Bottom (rank 3): 21.9,30.71 21.9,30.44 arc90 22.3,30.04 22.71,30.04 26.38,30.71 27.58,30.71 28.77,31.71 30.78,34.64 31.51,34.65 32.98,34.58 33.7,33.4 34.07,32.74 34.1,30.58 32.61,30.56 32.35,29.63 32.68,29.27 33.88,29.51 37.13,29.47 37.81,29.03 39.03,28.95 39.41,29.51 38.64,30.24 38.09,30.34 37.31,30.31 35.35,30.35 35.28,31.3 34.65,35.25 34.02,35.34 32.07,35.74 30.59,35.91 28.34,35.96 27.45,33.65 27.39,32.07 27.15,31.74 26.19,31.82 24.84,31.88 22.79,31.27 22.32,31.14
VSS_1  (via drill 0.6)
  Top 0.203: v32.69,28.45 33.1,27.3 U1.31
  Bottom 0.203: 31.7,28.6 C11.1
  Bottom 0.305: v32.69,28.45 31.7,28.6
VSS_2  (via drill 0.6 pad 0.3)
  Top 0.203: U1.47 29.5,17.62 28.88,17.26 v28.63,16.1
  Bottom 0.203: v28.63,16.1 28.44,15.96 28.87,15.32 C13.1

### Text on the board
tNames: DIGITAL | 3.3V | ANALOG | RPM
bNames: 5 | 3.2 | 5 | 3.3
tValues: 3.3V | DIGITAL | +5V | 3.2v | ANALOG | 3.2